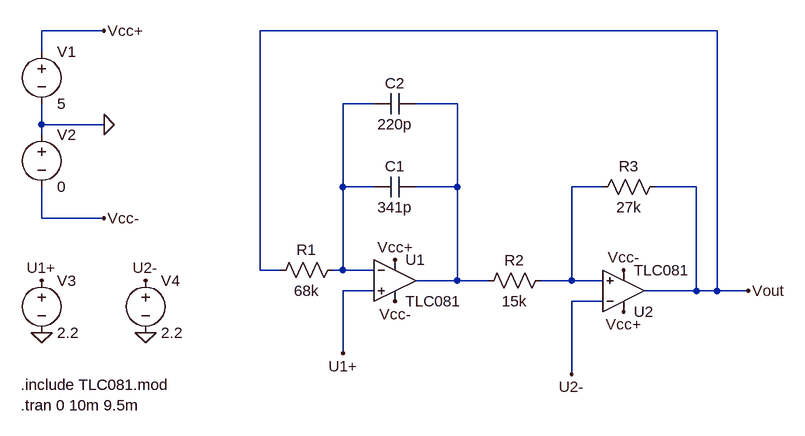
[diagram p0: schematic Phase-2-MODDED-hardware-design.asc]
Phase-2-MODDED-hardware-design.asc, the LTspice schematic file:
Version 4
SHEET 1 880 680
WIRE -544 -272 -640 -272
WIRE 400 -272 -304 -272
WIRE -640 -240 -640 -272
WIRE -128 -160 -176 -160
WIRE 0 -160 -64 -160
WIRE -640 -128 -640 -160
WIRE -544 -128 -640 -128
WIRE -640 -112 -640 -128
WIRE -176 -32 -176 -160
WIRE -128 -32 -176 -32
WIRE 0 -32 0 -160
WIRE 0 -32 -64 -32
WIRE 224 -32 176 -32
WIRE 368 -32 304 -32
WIRE -640 16 -640 -32
WIRE -544 16 -640 16
WIRE -304 96 -304 -272
WIRE -272 96 -304 96
WIRE -176 96 -176 -32
WIRE -176 96 -192 96
WIRE -128 96 -176 96
WIRE 0 112 0 -32
WIRE 0 112 -64 112
WIRE 48 112 0 112
WIRE 176 112 176 -32
WIRE 176 112 128 112
WIRE 224 112 176 112
WIRE -128 128 -176 128
WIRE 368 128 368 -32
WIRE 368 128 288 128
WIRE 400 128 400 -272
WIRE 400 128 368 128
WIRE 448 128 400 128
WIRE 224 144 176 144
WIRE -176 224 -176 128
WIRE 176 256 176 144
FLAG -544 -128 0
FLAG -544 -272 Vcc+
FLAG -544 16 Vcc-
FLAG -96 80 Vcc+
FLAG 256 160 Vcc+
FLAG -96 144 Vcc-
FLAG 256 96 Vcc-
FLAG -640 192 0
FLAG -480 192 0
FLAG -640 112 U1+
FLAG -176 224 U1+
FLAG -480 112 U2-
FLAG 176 256 U2-
FLAG 448 128 Vout
SYMBOL OpAmps\\opamp2 -96 48 R0
SYMATTR InstName U1
SYMATTR Value TLC081
SYMBOL OpAmps\\opamp2 256 192 M180
SYMATTR InstName U2
SYMATTR Value TLC081
SYMBOL voltage -640 -256 R0
WINDOW 123 0 0 Left 0
WINDOW 39 0 0 Left 0
SYMATTR InstName V1
SYMATTR Value 5
SYMBOL voltage -640 -128 R0
WINDOW 123 0 0 Left 0
WINDOW 39 0 0 Left 0
SYMATTR InstName V2
SYMATTR Value 0
SYMBOL res -176 80 R90
WINDOW 0 0 56 VBottom 2
WINDOW 3 32 56 VTop 2
SYMATTR InstName R1
SYMATTR Value 68k
SYMBOL res 144 96 R90
WINDOW 0 0 56 VBottom 2
WINDOW 3 32 56 VTop 2
SYMATTR InstName R2
SYMATTR Value 15k
SYMBOL res 320 -48 R90
WINDOW 0 0 56 VBottom 2
WINDOW 3 32 56 VTop 2
SYMATTR InstName R3
SYMATTR Value 27k
SYMBOL cap -64 -48 R90
WINDOW 0 0 32 VBottom 2
WINDOW 3 32 32 VTop 2
SYMATTR InstName C1
SYMATTR Value 341p
SYMBOL voltage -640 96 R0
WINDOW 123 0 0 Left 0
WINDOW 39 0 0 Left 0
SYMATTR InstName V3
SYMATTR Value 2.2
SYMBOL voltage -480 96 R0
WINDOW 123 0 0 Left 0
WINDOW 39 0 0 Left 0
SYMATTR InstName V4
SYMATTR Value 2.2
SYMBOL cap -64 -176 R90
WINDOW 0 0 32 VBottom 2
WINDOW 3 32 32 VTop 2
SYMATTR InstName C2
SYMATTR Value 220p
TEXT -672 272 Left 2 !.include TLC081.mod
TEXT -672 304 Left 2 !.tran 0 10m 9.5m

The netlist it stands for:
* Phase-2-MODDED-hardware-design.asc
XU1 U1+ N001 Vcc+ Vcc- N002 TLC081  ; pins In+ In- V+ V- OUT
XU2 N003 U2- Vcc+ Vcc- Vout TLC081  ; pins In+ In- V+ V- OUT
V1 Vcc+ 0 5
V2 0 Vcc- 0
R1 N001 Vout 68k
R2 N003 N002 15k
R3 Vout N003 27k
C1 N002 N001 341p
V3 U1+ 0 2.2
V4 U2- 0 2.2
C2 N002 N001 220p
.include TLC081.mod
.tran 0 10m 9.5m
.backanno
.end